# Altium project Eliot12L-Touch02.PrjPcb
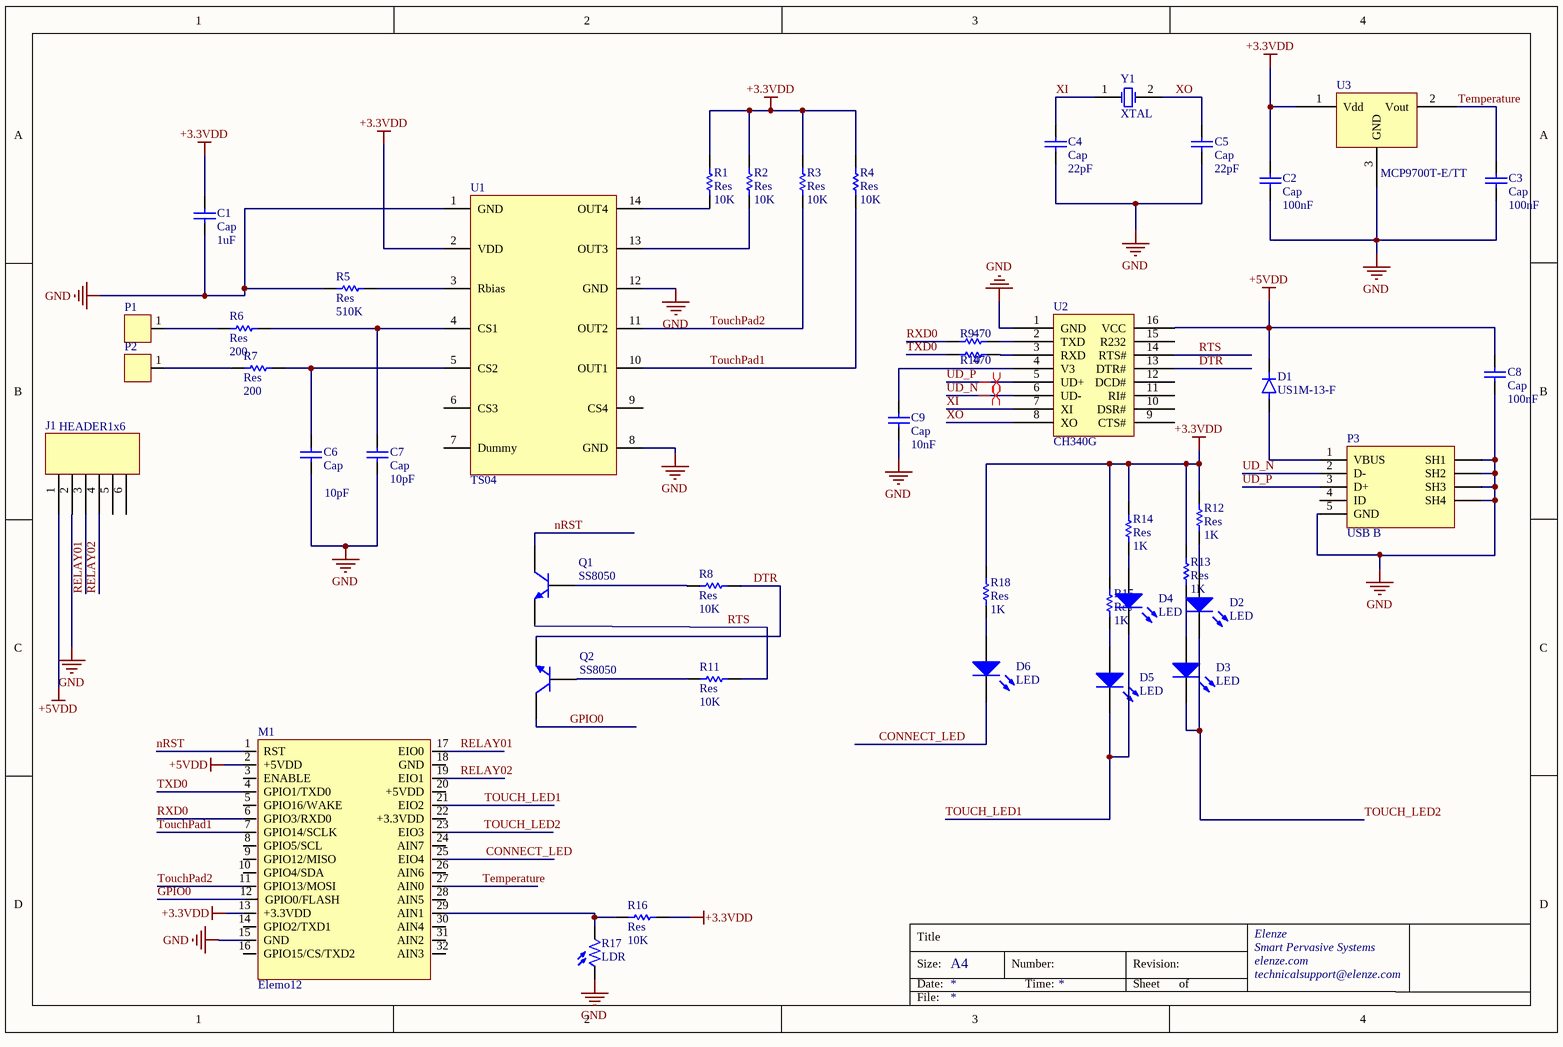
[diagram p0: Touch02.SchDoc]
1 sheet, 44 parts. Net scope: global (net labels, ports and power ports of the same name join across sheets).
Board file: Eliot12L-Touch02.PcbDoc

## Sheet Touch02.SchDoc
size A4; Organization: Elenze; Address1: Smart Pervasive Systems; Address2: elenze.com; Address3: technicalsupport@elenze.com

### Parts
C1  Cap  value 1uF  [0805]
C2  Cap  value 100nF  [0402]
C3  Cap  value 100nF  [0402]
C4  Cap  value 22pF  [0402]
C5  Cap  value 22pF  [0402]
C6  Cap  value 10pF  [0402]
C7  Cap  value 10pF  [0402]
C8  Cap  value 100nF  [0402]
C9  Cap  value 10nF  [0402]
D1  US1M-13-F  [DIO_ES1J]
D2  LED  [DO603]
D3  LED  [DO603]
D4  LED  [DO603]
D5  LED  [DO603]
D6  LED  [DO603]
J1  HEADER1x6  [HDR_1X6_2.54_SMT]
M1  Elemo12  [Elemo12_No_screw]
P1  CapacitivePad  [TouchPad10x10]  (value not drawn)
P2  CapacitivePad  [TouchPad10x10]  (value not drawn)
P3  USB B  [USB_MINI_SMD]
Q1  SS8050  [SOT-23]
Q2  SS8050  [SOT-23]
R1  Res  value 10K  [0402]
R2  Res  value 10K  [0402]
R3  Res  value 10K  [0402]
R4  Res  value 10K  [0402]
R5  Res  value 510K  [0402]
R6  Res  value 200  [0402]
R7  Res  value 200  [0402]
R8  Res  value 10K  [0402]
R9  value 470  [0402]  (hidden comment: Res)
R10  value 470  [0402]  (hidden comment: Res)
R11  Res  value 10K  [0402]
R12  Res  value 1K  [0402]
R13  Res  value 1K  [0402]
R14  Res  value 1K  [0402]
R15  Res  value 1K  [0402]
R16  Res  value 10K  [0402]
R17  LDR  [LDR]
R18  Res  value 1K  [0402]
U1  TS04  [SO_14N]
U2  CH340G  [SO_16N]
U3  MCP9700T-E/TT  [SOT-23]
Y1  XTAL  [xtal-smd]

### Nets
+3.3VDD: C1.2 C2.2 M1.13(+3.3VDD) R1.2 R2.2 R3.2 R4.2 R12.1 R13.1 R14.1 R15.1 R16.1 R18.1 U1.2(VDD) U3.1(Vdd)
+5VDD: C8.2 D1.K J1.1 M1.2(+5VDD) U2.16(VCC)
GND: C1.1 C2.1 C3.1 C4.1 C5.1 C6.1 C7.1 C8.1 C9.1 J1.2 M1.15(GND) P3.5(GND) P3.SH1 P3.SH2 P3.SH3 P3.SH4 R5.2 R17.1 U1.1(GND) U1.8(GND) U1.12(GND) U2.1(GND) U3.3(GND)
CONNECT_LED: D6.2(K) M1.25(EIO4)
DTR: Q2.2(E) R8.2 U2.13(DTR#)
GPIO0: M1.12(GPIO0/FLASH) Q2.3(C)
nRST: M1.1(RST) Q1.3(C)
RELAY01: J1.3 M1.17(EIO0)
RELAY02: J1.4 M1.19(EIO1)
RTS: Q1.2(E) R11.2 U2.14(RTS#)
RXD0: M1.6(GPIO3/RXD0) R9.1
Temperature: C3.2 M1.27(AIN0) U3.2(Vout)
TOUCH_LED1: D4.2(K) D5.2(K) M1.21(EIO2)
TOUCH_LED2: D2.2(K) D3.2(K) M1.23(EIO3)
TouchPad1: M1.7(GPIO14/SCLK) R4.1 U1.10(OUT1)
TouchPad2: M1.11(GPIO13/MOSI) R3.1 U1.11(OUT2)
TXD0: M1.4(GPIO1/TXD0) R10.1
UD_N: P3.2(D-) U2.6(UD-)
UD_P: P3.3(D+) U2.5(UD+)
XI: C4.2 U2.7(XI) Y1.1(OSC1)
XO: C5.2 U2.8(XO) Y1.2(OSC2)
NetC6_2: C6.2 R7.1 U1.5(CS2)
NetC7_2: C7.2 R6.1 U1.4(CS1)
NetC9_2: C9.2 U2.4(V3)
NetD1_A: D1.A P3.1(VBUS)
NetD2_1: D2.1(A) R12.2
NetD3_1: D3.1(A) R13.2
NetD4_1: D4.1(A) R14.2
NetD5_1: D5.1(A) R15.2
NetD6_1: D6.1(A) R18.2
NetM1_29: M1.29(AIN1) R16.2 R17.2
NetP1_1: P1.1 R6.2
NetP2_1: P2.1 R7.2
NetQ1_1: Q1.1(B) R8.1
NetQ2_1: Q2.1(B) R11.1
NetR1_1: R1.1 U1.14(OUT4)
NetR2_1: R2.1 U1.13(OUT3)
NetR5_1: R5.1 U1.3(Rbias)
NetR9_2: R9.2 U2.2(TXD)
NetR10_2: R10.2 U2.3(RXD)

Not connected (* = marked no-connect by the designer): J1 5 6; M1 3(ENABLE) 5(GPIO16/WAKE) 8(GPIO5/SCL) 9(GPIO12/MISO) 10(GPIO4/SDA) 14(GPIO2/TXD1) 16(GPIO15/CS/TXD2) 18(GND) 20(+5VDD) 22(+3.3VDD) 24(AIN7) 26(AIN6) 28(AIN5) 30(AIN4) 31(AIN2) 32(AIN3); P3 4(ID); U1 6(CS3) 7(Dummy) 9(CS4); U2 9(CTS#) 10(DSR#) 11(RI#) 12(DCD#) 15(R232)

### Layout directives
differential pair: UD_N, UD_P

### Notes on the sheet
- Title
- Size:
- Date:
- A4
- Number:
- Time:
- Revision:
- Sheet
- of
- File:

### Library data of the parts
C1-C9 = Cap: Capacitor; Published: 8-Jun-2000; LatestRevisionDate: 17-Jul-2002; LatestRevisionNote: Re-released for DXP Platform.; PackageReference: RAD-0.3; Publisher: Altium Limited; PackageDescription: Radial Cap, Thru-Hole; 2 Leads; 0.3 in Pin Spacing
D1 = US1M-13-F: Diode Standard 1000V 1A Surface Mount SMA; MF: Diodes Inc.; Package: DO-214 Diodes Inc.; Value: *; Price: None; MP: US1M-13-F; Availability: Unavailable; SnapEDA_Link: https://www.snapeda.com/parts/US1M-13-F/Diodes%20Inc./view-part/270779/?ref=snap
D2-D6 = LED: Typical INFRARED GaAs LED; Published: 8-Jun-2000; LatestRevisionDate: 08-Jul-2005; LatestRevisionNote: Mech Layer 1 removed.; PackageReference: LED-0; Publisher: Altium Limited; PackageDescription: LED; 2 Leads
J1 = HEADER1x6: HEADER 1x6
M1 = Elemo12: Elenze Module ESP-12 Secured with Expanded Analog/Digital IO
P3 = A-USBB-M5/SMD: USB 1.1 connector - style B-Mini, SMD, Female, 5 contacts; Manufacturer: Assmann WSW components; Rating: 1A; Link to Datasheet: *; Link to Picture: *; Operating Temp: -55°C ~ 85°C; Storage Temp: -55°C ~ 85°C; ComponentLink1URL: *; ComponentLink1Description: *; Manufacture Part #: A-USBB-M5/SMD; Value: USB B
Q1 Q2 = SS8050: NPN General Purpose Amplifier; Published: 8-Jun-2000; LatestRevisionDate: 15-Jan-2003; LatestRevisionNote: PCB Footprint 'BCY-W3/D4.7' replaced; DatasheetVersion: 1997; PackageVersion: Sep-1998; PackageReference: TO-92A; Publisher: Altium Limited; PackageDescription: TO, Flat Index; 3 In-Line, Axial Leads; Body Dia. 4.5mm; Leads 0.51 x 0.48 mm (max); ComponentLink1Description: Manufacturer Link; ComponentLink1URL: http://www.fairchildsemi.com/; ComponentLink2Description: Datasheet; ComponentLink2URL: http://www.fairchildsemi.com/ds/2N%2F2N3904.pdf
R1-R16 R18 = Res: Resistor; Published: 8-Jun-2000; LatestRevisionDate: 17-Jul-2002; LatestRevisionNote: Re-released for DXP Platform.; PackageReference: AXIAL-0.3; Publisher: Altium Limited; PackageDescription: Axial Device, Thru-Hole; 2 Leads; 0.3 in Pin Spacing
R17 = LDR: CdS Cells 520nm 16 ~ 33kOhms @ 10 lux; MF: Advanced Photonix; MP: PDV-P8103; Value: *; Price: None; Package: Radial Advanced Photonix; SnapEDA_Link: https://www.snapeda.com/parts/PDV-P8103/Advanced%20Photonix/view-part/558244/?ref=snap; Availability: Unavailable
U1 = TS04: 4-Channel Self Calibration Capacitive Touch Sensor; Manufacturer: touchSEMI; Part Number: TS04; Package: 14SOP
U2 = CH340G: USB to Serial Converter
U3 = MCP9700T-E/TT: Low-Power Linear Active Thermistor
Y1 = XTAL: Crystal Oscillator; Published: 8-Jun-2000; LatestRevisionDate: 17-Jul-2002; LatestRevisionNote: Re-released for DXP Platform.; PackageReference: R38; Publisher: Altium Limited; PackageDescription: Crystal, Thru-Hole; 2 Leads; Body 3.1 x 8.2 mm (Dia.xH)